# EAGLE design hbridge-motherboard (EAGLE 6.4)
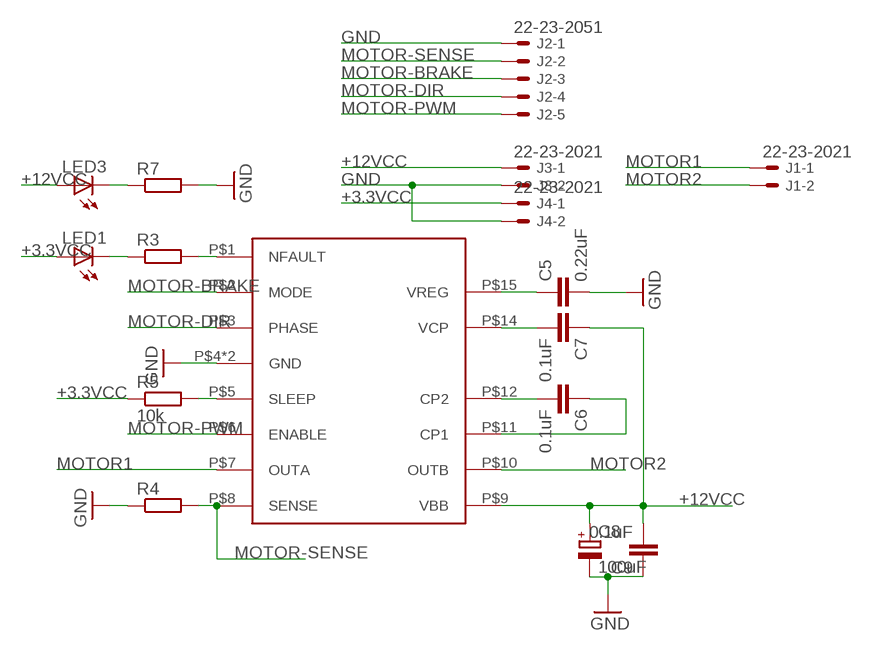
[diagram p0: schematic, sheet 1]

## Parts
C5  0.22uF  C-EU050-024X044  [C050-024X044]
C6  0.1uF  C-EU050-024X044  [C050-024X044]
C7  0.1uF  C-EU050-024X044  [C050-024X044]
C8  100uF  CPOL-EUE3.5-8  [E3,5-8]
C9  0.1uF  C-EU050-024X044  [C050-024X044]
J1  22-23-2021  [22-23-2021]
J2  22-23-2051  [22-23-2051]
J3  22-23-2021  [22-23-2021]
J4  22-23-2021  [22-23-2021]
LED1  LED3MM  [LED3MM]
LED3  LED3MM  [LED3MM]
R3  R-EU_0207/7  [0207/7]
R4  R-EU_0207/7  [0207/7]
R5  10k  R-EU_0207/7  [0207/7]
R7  R-EU_0207/7  [0207/7]
U$1  A3950-DIL  [DIL16]

## Nets
+3.3VCC: J4.1 LED1.A R5.1
+12VCC: C7.1 C8.+ C9.2 J3.1 LED3.A U$1.P$9(VBB)
GND: C5.2 C8.- C9.1 J2.1 J3.2 J4.2 R4.1 R7.2 U$1.P$4(GND) U$1.P$13(GND)
MOTOR1: J1.1 U$1.P$7(OUTA)
MOTOR2: J1.2 U$1.P$10(OUTB)
MOTOR-BRAKE: J2.3 U$1.P$2(MODE)
MOTOR-DIR: J2.4 U$1.P$3(PHASE)
MOTOR-PWM: J2.5 U$1.P$6(ENABLE)
MOTOR-SENSE: J2.2 R4.2 U$1.P$8(SENSE)
N$1: C5.1 U$1.P$15(VREG)
N$6: C6.2 U$1.P$12(CP2)
N$7: C6.1 U$1.P$11(CP1)
N$8: C7.2 U$1.P$14(VCP)
N$10: R3.2 U$1.P$1(NFAULT)
N$11: LED1.K(C) R3.1
N$13: R5.2 U$1.P$5(SLEEP)
N$14: LED3.K(C) R7.1

## Library data of the parts
C5-C7 C9 = rcl:C-EU: CAPACITOR, European symbol
C8 = resistor:CPOL-EU: POLARIZED CAPACITOR, European symbol
J1 J3 J4 = con-molex:22-23-2021: .100" (2.54mm) Center Header - 2 Pin; MF: MOLEX; MPN: 22-23-2021; OC_FARNELL: 1462926; OC_NEWARK: 25C3832
J2 = con-molex:22-23-2051: .100" (2.54mm) Center Header - 5 Pin; MF: MOLEX; MPN: 22-23-2051; OC_FARNELL: 1462952; OC_NEWARK: 38C9178
LED1 LED3 = adafruit:LED: LED OSRAM: - CHIPLED LG R971, LG N971, LY N971, LG Q971, LY Q971, LO R971, LY R971 LH N974, LH R974 LS Q976, LO Q976, LY Q976 LO Q996 - Hyper CHIPLED LW Q18S LB Q993, LB Q99A, LB R99A - SideLED LS A670, LO A670, LY A670, LG A670, LP A670 LB A673, LV A673, LT A673, LW A673 LH A674 LY A675 LS A676, LA A676, LO A676, LY A676, LW A676 LS A679, LY A679, LG A679 - Hyper Micro SIDELED® LS Y876, LA Y876, LO Y876, LY Y876 LT Y87S - SmartLED LW L88C, LW L88S LB L89C, LB L89S, LG L890 LS L89K, LO L89K, LY L89K LS L896, LA L896, LO L896, LY L896 - TOPLED LS T670, LO T670, LY T670, LG T670, LP T670 LSG T670, LSP T670, LSY T670, LOP T670, LYG T670 LG T671, LOG T671, LSG T671 LB T673, LV T673, LT T673, LW T673 LH T674 LS T676, LA T676, LO T676, LY T676, LB T676, LH T676, LSB T676, LW T676 LB T67C, LV T67C, LT T67C, LS T67K, LO T67K, LY T67K, LW E67C LS E67B, LA E67B, LO E67B, LY E67B, LB E67C, LV E67C, LT E67C LW T67C LS T679, LY T679, LG T679 LS T770, LO T770, LY T770, LG T770, LP T770 LB T773, LV T773, LT T773, LW T773 LH T774 LS E675, LA E675, LY E675, LS T675 LS T776, LA T776, LO T776, LY T776, LB T776 LHGB T686 LT T68C, LB T68C - Hyper Mini TOPLED® LB M676 - Mini TOPLED Santana® LG M470 LS M47K, LO M47K, LY M47K Source: http://www.osram.convergy.de/
R3-R5 R7 = rcl:R-EU_: RESISTOR, European symbol
U$1 = A3950:A3950-DIL

## Net classes
0 default: clearance 0.355 mm

## Board
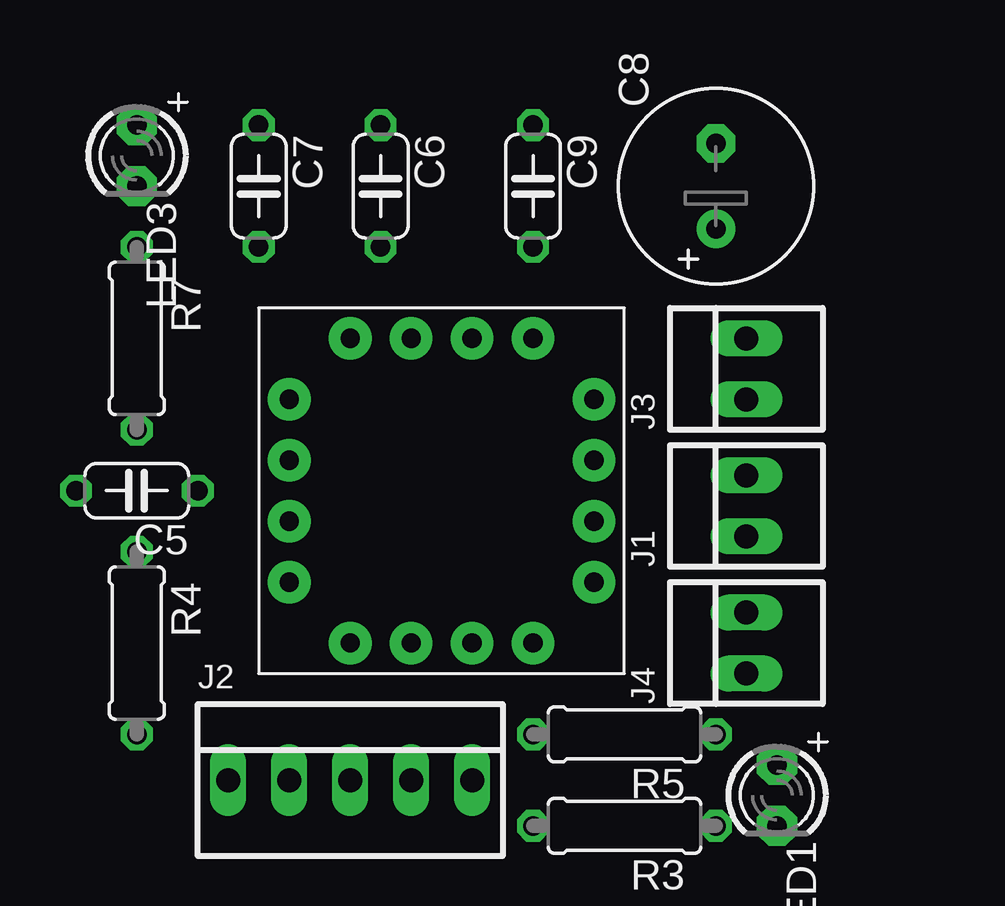
[diagram p1: board, top side]
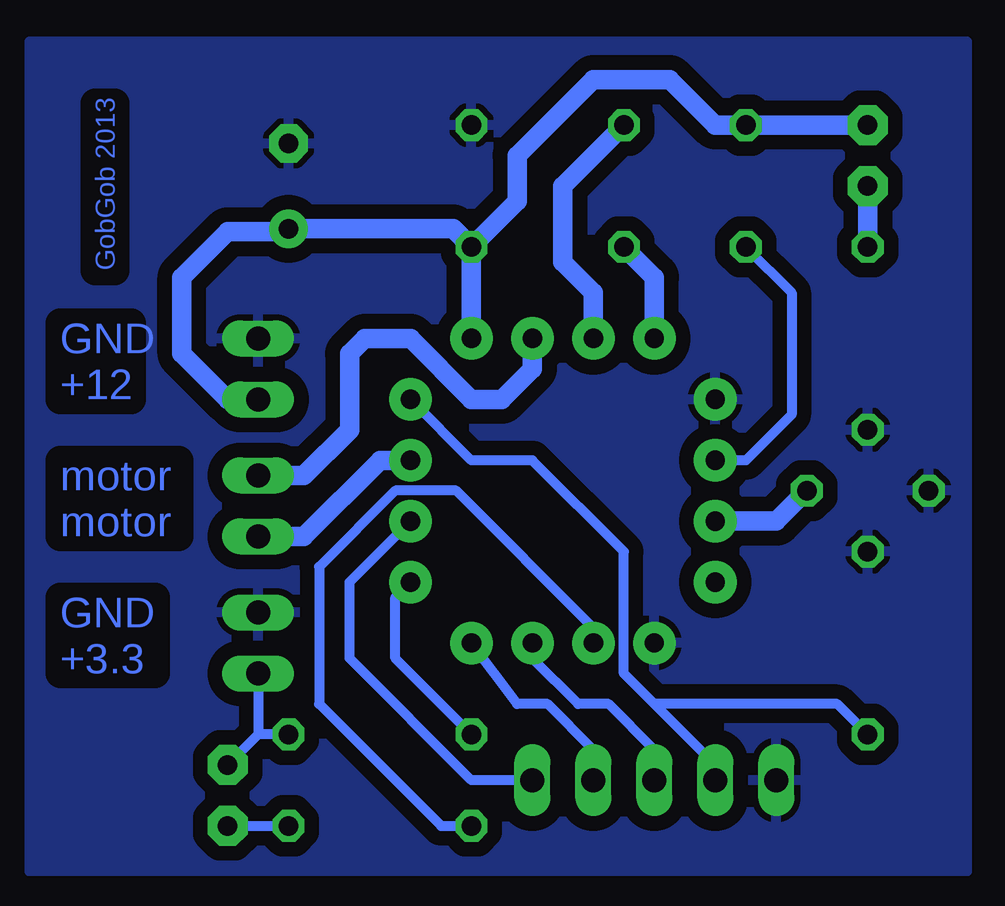
[diagram p2: board, bottom side, seen from below]

No outline drawn. Coordinates in mm, seen from the top.
Copper layers (1*16): Top 0.035mm / dielectric 1.5mm / Bottom 0.035mm
Design rules "default": minimum track width 10mil, minimum drill 24mil, track to track 8mil, track to pad 8mil, pad to pad 8mil, via to via 8mil, smd to smd 8mil, copper to edge 40mil, drill to drill 8mil, minimum pad ring 10mil, minimum via ring 8mil, stop-mask expansion 4mil, vias tented up to drill 0mil, thermal gap 10mil

### Footprints (pad centres in the part's own frame; a part is rotated, then mirrored left to right if it is on the bottom)
C050-024X044 = drill 0.813 octagon: 1 -2.54,0; 2 2.54,0
E3,5-8 = drill 0.813 pad 1.6: + -1.778,0 | drill 0.813 pad 1.6 octagon: - 1.778,0
22-23-2021 = drill 1 long: 1 -1.27,0; 2 1.27,0
22-23-2051 = drill 1 long: 1 -5.08,0; 2 -2.54,0; 3 0,0; 4 2.54,0; 5 5.08,0
LED3MM = drill 0.813 pad 1.676 octagon: A -1.27,0; K 1.27,0
0207/7 = drill 0.813 octagon: 1 -3.81,0; 2 3.81,0
DIL16 = drill 0.8 pad 1.778: P$1 -1.27,-6.35; P$2 1.27,-6.35; P$3 3.81,-6.35; P$4 -3.81,-6.35; P$5 6.35,-3.81; P$6 6.35,-1.27; P$7 6.35,1.27; P$8 6.35,3.81; P$9 3.81,6.35; P$10 1.27,6.35; P$11 -1.27,6.35; P$12 -3.81,6.35; P$13 -6.35,3.81; P$14 -6.35,1.27; P$15 -6.35,-1.27; P$16 -6.35,-3.81

### Placement (x,y rotation side)
C5  -16.51,-26.67 180 top
C6  -6.35,-13.97 270 top
C7  -11.43,-13.97 270 top
C8  7.62,-13.97 90 top
C9  0,-13.97 270 top
J1  8.89,-27.3 90 top
J2  -7.62,-38.73 0 top
J3  8.89,-21.59 90 top
J4  8.89,-33.02 90 top
LED1  10.16,-39.37 270 top
LED3  -16.51,-12.7 270 top
R3  3.81,-40.64 180 top
R4  -16.51,-33.02 270 top
R5  3.81,-36.83 180 top
R7  -16.51,-20.32 270 top
U$1  -3.81,-26.67 0 top

### Tracks (layer width: path | path; a pad name or v marks a point on that pad's centre or on a via)
+3.3VCC
  Bottom 0.406: J4.1 8.89,-36.83 | 8.89,-36.83 LED1.A | R5.1 8.89,-36.83
+12VCC
  Bottom 0.813: J3.1 10.16,-22.86 12.06,-20.95 12.06,-17.78 10.16,-15.88 7.75,-15.88 C8.+ 0.76,-15.75 C9.2 | U$1.P$9 C9.2 | LED3.A C7.1 -10.16,-11.43 -8.26,-9.53 -5.08,-9.53 -1.91,-12.7 -1.91,-14.61 C9.2
GND
  pour Bottom (isolate 0.61): -20.64,-7.94 -20.64,-42.55 18.41,-42.55 18.41,-7.94
MOTOR1
  Bottom 0.813: U$1.P$7 3.81,-25.4 6.99,-28.57 J1.1
MOTOR2
  Bottom 0.813: U$1.P$10 -2.54,-21.59 -1.27,-22.86 0,-22.86 2.54,-20.32 4.45,-20.32 5.08,-20.95 5.08,-24.13 6.99,-26.04 J1.2
MOTOR-BRAKE
  Bottom 0.406: J2.3 -7.62,-37.47 -5.71,-35.56 -4.45,-35.56 -2.54,-33.66 U$1.P$2
MOTOR-DIR
  Bottom 0.406: J2.4 -5.08,-37.47 -3.17,-35.56 -1.91,-35.56 U$1.P$3
MOTOR-PWM
  Bottom 0.406: J2.5 0,-38.73 5.08,-33.66 5.08,-30.48 U$1.P$6
MOTOR-SENSE
  Bottom 0.406: U$1.P$8 0,-25.4 -2.54,-25.4 -6.35,-29.21 -6.35,-34.29 -7.62,-35.56 | R4.2 -15.24,-35.56 -7.62,-35.56 | J2.2 -10.16,-38.1 -7.62,-35.56
N$1
  Bottom 0.813: U$1.P$15 -12.7,-27.94 C5.1
N$6
  Bottom 0.813: U$1.P$12 -7.62,-17.78 C6.2
N$7
  Bottom 0.813: C6.1 -3.81,-13.97 -3.81,-17.14 -5.08,-18.41 U$1.P$11
N$8
  Bottom 0.406: C7.2 -13.34,-18.41 -13.34,-23.5 -11.43,-25.4 U$1.P$14
N$10
  Bottom 0.406: U$1.P$1 -5.08,-32.38 0.64,-26.67 3.17,-26.67 6.35,-29.84 6.35,-35.56 1.27,-40.64 R3.2
N$11
  Bottom 0.406: LED1.K R3.1
N$13
  Bottom 0.406: R5.2 3.17,-33.66 3.17,-31.11 U$1.P$5
N$14
  Bottom 0.813: LED3.K R7.1

### Text on the board
Bottom: GobGob 2013 | GND / +12 | motor / motor | GND / +3.3
_tNames: C4 | IC1 | R1 | C1 | IC2 | C3 | R2 | C2 | JP1